# EasyEDA schematic EASY_EDA_FILE_SCHEMATIC.json
TITLE: Projeto Magic Chess; REV: 1.1; Date: 2025-01-30; Sheet: 1/1; Drawn By: Felipe Lambak; Company: Fab Lab 25.1
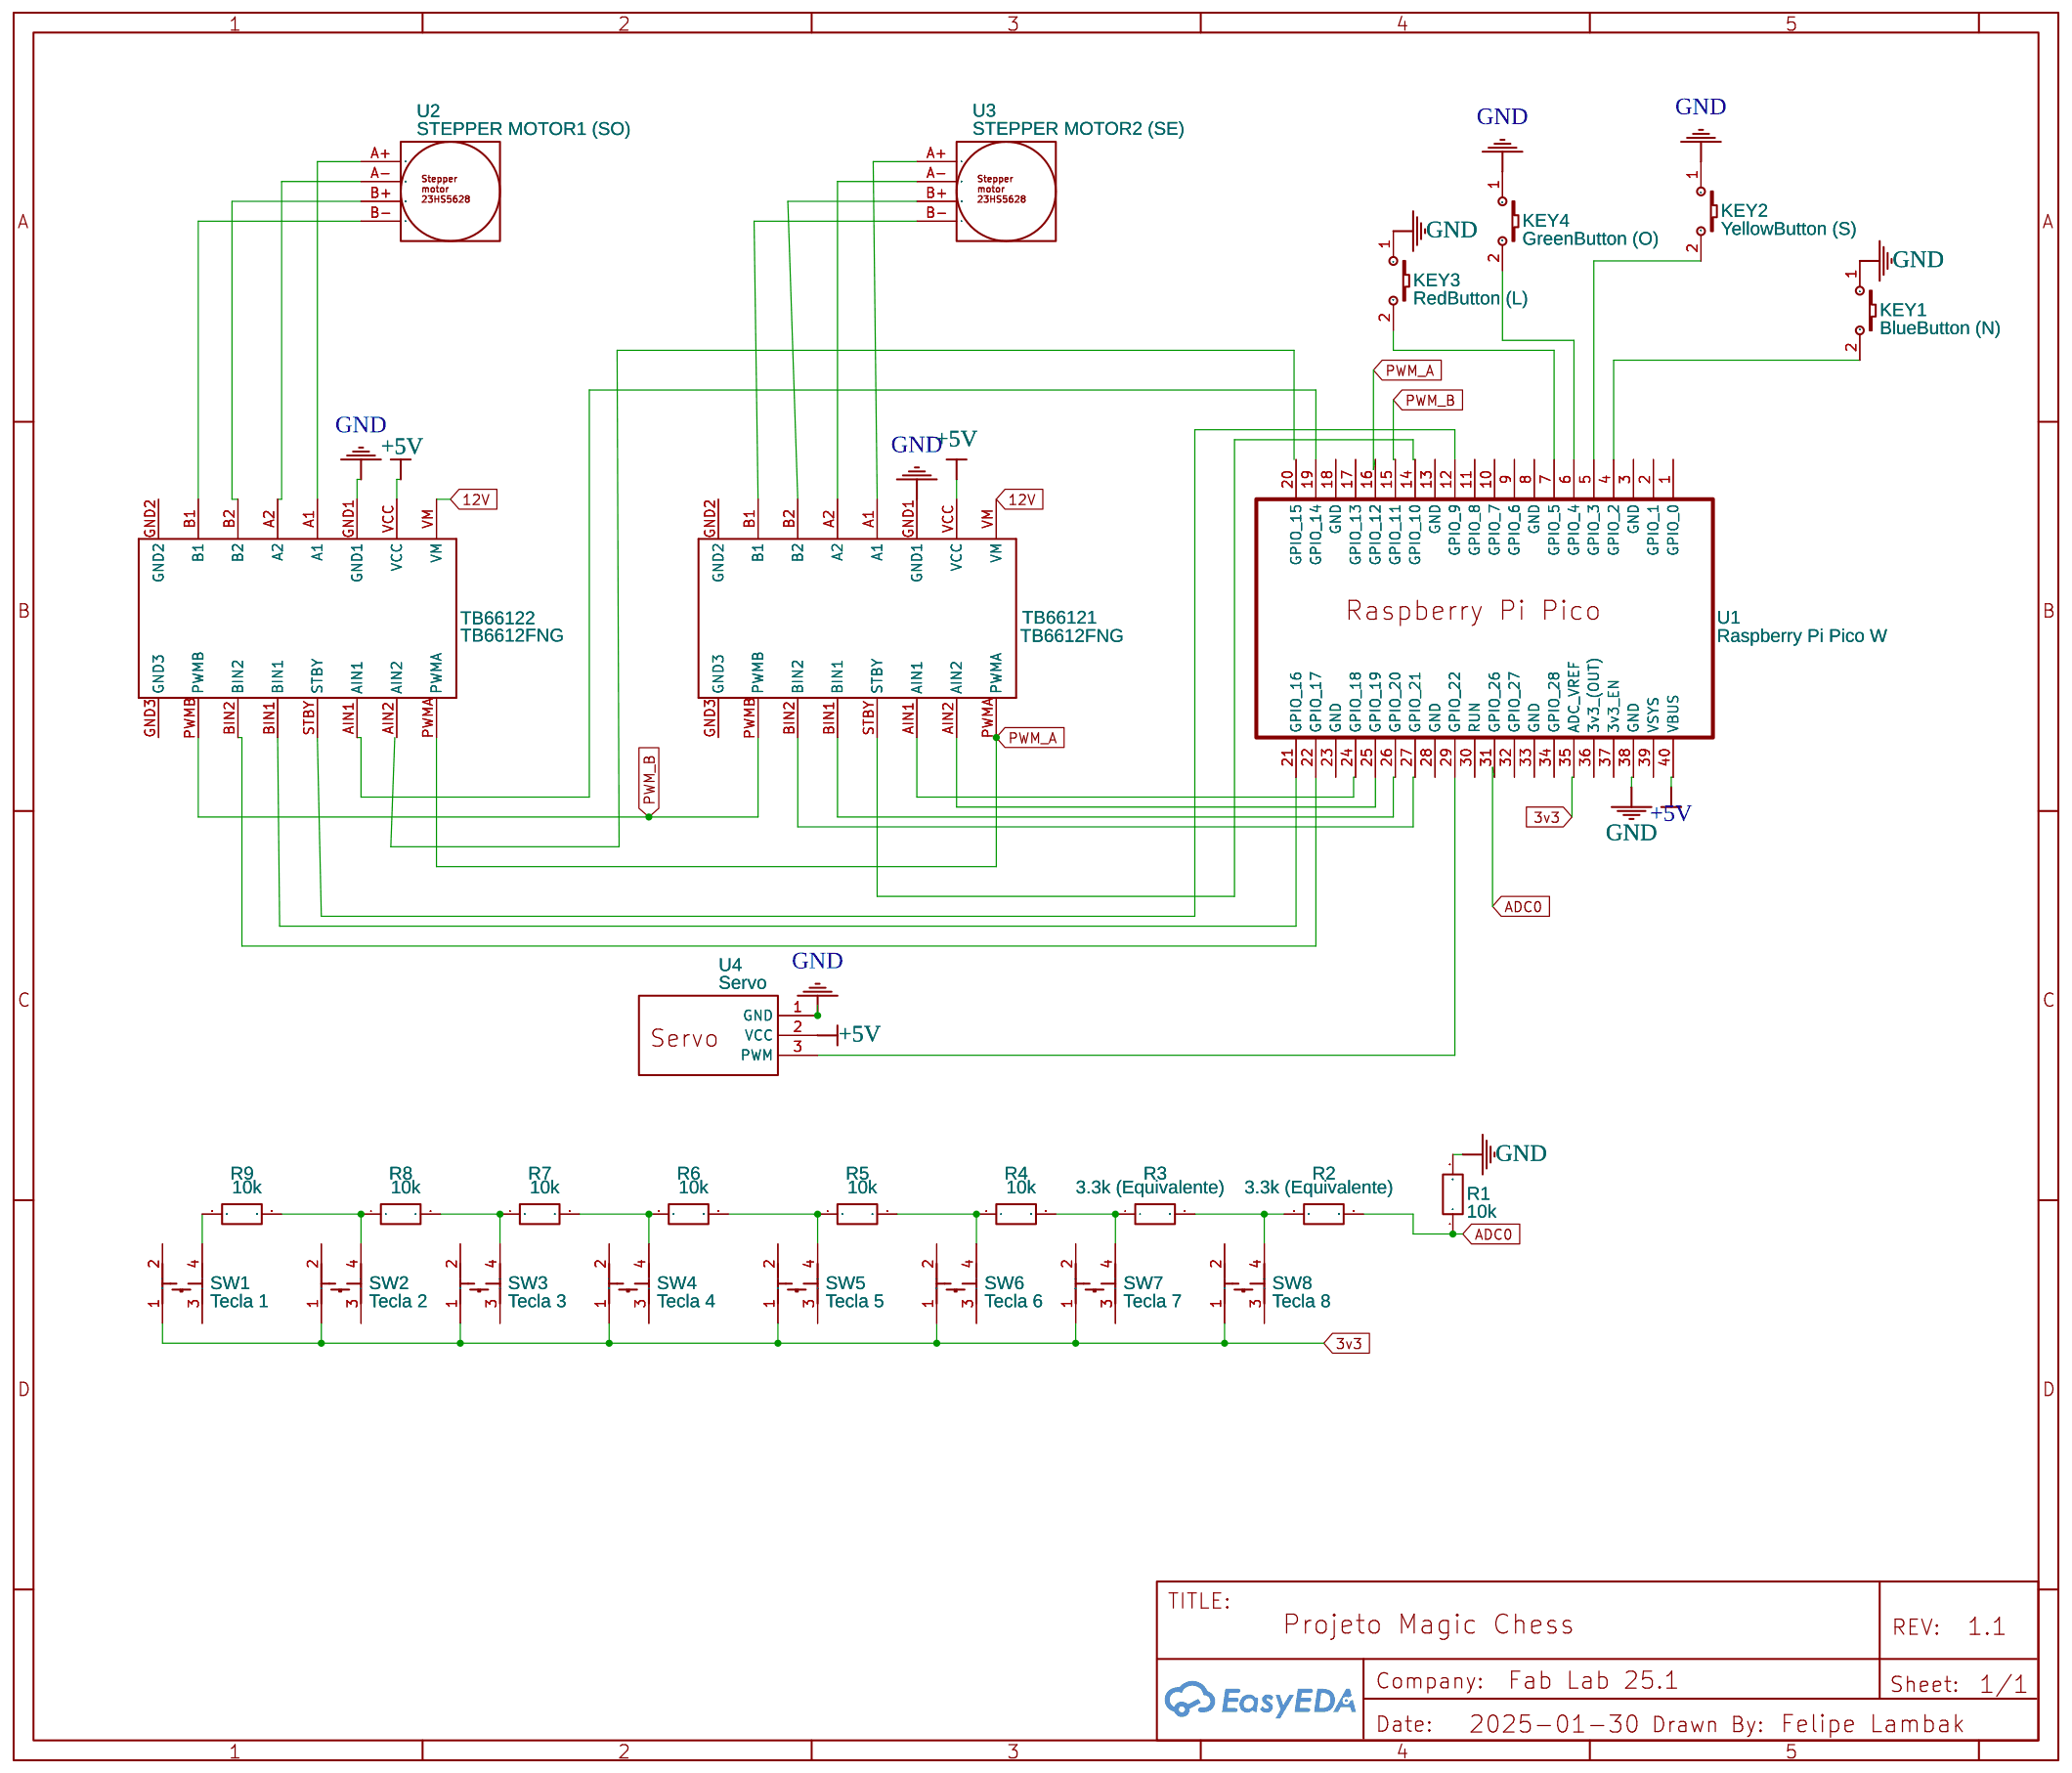
[diagram p0: schematic sheet]

## Parts
KEY1  BlueButton (N)  [KEY-SMD_2P-L6.2-W3.6-LS8.0]
KEY2  YellowButton (S)  [KEY-SMD_2P-L6.2-W3.6-LS8.0]
KEY3  RedButton (L)  [KEY-SMD_2P-L6.2-W3.6-LS8.0]
KEY4  GreenButton (O)  [KEY-SMD_2P-L6.2-W3.6-LS8.0]
R1  10k  [R0603]
R2  3.3k (Equivalente)  [R0603]
R3  3.3k (Equivalente)  [R0603]
R4  10k  [R0603]
R5  10k  [R0603]
R6  10k  [R0603]
R7  10k  [R0603]
R8  10k  [R0603]
R9  10k  [R0603]
SW1  Tecla 1  [SW-SMD_4P-L4.2-W3.2-P2.15-LS5.2]
SW2  Tecla 2  [SW-SMD_4P-L4.2-W3.2-P2.15-LS5.2]
SW3  Tecla 3  [SW-SMD_4P-L4.2-W3.2-P2.15-LS5.2]
SW4  Tecla 4  [SW-SMD_4P-L4.2-W3.2-P2.15-LS5.2]
SW5  Tecla 5  [SW-SMD_4P-L4.2-W3.2-P2.15-LS5.2]
SW6  Tecla 6  [SW-SMD_4P-L4.2-W3.2-P2.15-LS5.2]
SW7  Tecla 7  [SW-SMD_4P-L4.2-W3.2-P2.15-LS5.2]
SW8  Tecla 8  [SW-SMD_4P-L4.2-W3.2-P2.15-LS5.2]
TB66121  TB6612FNG  [TB6612FNG]
TB66122  TB6612FNG  [TB6612FNG]
U1  Raspberry Pi Pico W  [RASPBERRY PI PICO/ RASPBERRY PI PICO W]
U2  STEPPER MOTOR1 (SO)
U3  STEPPER MOTOR2 (SE)
U4  Servo  [SERVO SG90]

## Library data of the parts
KEY1-KEY4 = K2-3.6×6.1_SMD: Supplier Part: C118141; Supplier: LCSC; Manufacturer Part: K2-1107ST-A4SW-06; Contributor: LCEDA_Lib; 制造商: 韩国韩荣
R1-R9 = R_0603_EU: Contributor: LCEDA_Lib
SW1-SW8 = BUTTON-4X3X2.5: Contributor: lcsc; Supplier: LCSC; Supplier Part: C9900020294; Manufacturer: null; JLCPCB Part Class: Extended Part
TB66121 TB66122 = TB6612FNG: Contributor: pedrogrossi_
U1 = Raspberry Pi Pico W: Contributor: denojorim
U2 U3 = STEPPER MOTOR: Manufacturer Part: MOTOR; Contributor: MartinsCostaNelson
U4 = Servo: Contributor: mohdazharsm

## Nets
3v3: SW1.1 SW2.1 SW3.1 SW4.1 SW5.1 SW6.1 SW7.1 SW8.1 U1.35(ADC_VREF)
12V: TB66121.VM TB66122.VM
+5V: TB66121.VCC TB66122.VCC U1.40(VBUS) U4.2(VCC)
GND: KEY1.1 KEY2.1 KEY3.1 KEY4.1 R1.2 TB66121.GND1 TB66122.GND1 U1.38(GND) U4.1(GND)
ADC0: R1.1 R2.2 U1.31(GPIO 26)
PWM_A: TB66121.PWMA TB66122.PWMA U1.16(GPIO 12)
PWM_B: TB66121.PWMB TB66122.PWMB U1.15(GPIO 11)
Net-(KEY1-2): KEY1.2 U1.4(GPIO 2)
Net-(KEY2-2): KEY2.2 U1.5(GPIO 3)
Net-(KEY3-2): KEY3.2 U1.7(GPIO 5)
Net-(KEY4-2): KEY4.2 U1.6(GPIO 4)
Net-(R2-1): R2.1 R3.2 SW8.4
Net-(R3-1): R3.1 R4.2 SW7.4
Net-(R4-1): R4.1 R5.2 SW6.4
Net-(R5-1): R5.1 R6.2 SW5.4
Net-(R6-1): R6.1 R7.2 SW4.4
Net-(R7-1): R7.1 R8.2 SW3.4
Net-(R8-1): R8.1 R9.2 SW2.4
Net-(R9-1): R9.1 SW1.4
Net-(TB66121-A1): TB66121.A1 U3.A+(1)
Net-(TB66121-A2): TB66121.A2 U3.A-(2)
Net-(TB66121-AIN1): TB66121.AIN1 U1.24(GPIO 18)
Net-(TB66121-AIN2): TB66121.AIN2 U1.25(GPIO 19)
Net-(TB66121-B1): TB66121.B1 U3.B-(4)
Net-(TB66121-B2): TB66121.B2 U3.B+(3)
Net-(TB66121-BIN1): TB66121.BIN1 U1.26(GPIO 20)
Net-(TB66121-BIN2): TB66121.BIN2 U1.27(GPIO 21)
Net-(TB66121-STBY): TB66121.STBY U1.14(GPIO 10)
Net-(TB66122-A1): TB66122.A1 U2.A+(1)
Net-(TB66122-A2): TB66122.A2 U2.A-(2)
Net-(TB66122-AIN1): TB66122.AIN1 U1.19(GPIO 14)
Net-(TB66122-B1): TB66122.B1 U2.B-(4)
Net-(TB66122-B2): TB66122.B2 U2.B+(3)
Net-(TB66122-BIN1): TB66122.BIN1 U1.21(GPIO 16)
Net-(TB66122-BIN2): TB66122.BIN2 U1.22(GPIO 17)
Net-(TB66122-STBY): TB66122.STBY U1.12(GPIO 9)
Net-(U1-29): U1.29(GPIO 22) U4.3(PWM)

Not connected (* = marked no-connect by the designer): SW1 2 3; SW2 2 3; SW3 2 3; SW4 2 3; SW5 2 3; SW6 2 3; SW7 2 3; SW8 2 3; TB66121 GND2 GND3; TB66122 AIN2 GND2 GND3; U1 1(GPIO 0) 2(GPIO 1) 3(GND) 8(GND) 9(GPIO 6) 10(GPIO 7) 11(GPIO 8) 13(GND) 17(GPIO 13) 18(GND) 20(GPIO 15) 23(GND) 28(GND) 30(RUN) 32(GPIO 27) 33(GND) 34(GPIO 28) 36(3v3 (OUT)) 37(3v3_EN) 39(VSYS)
